# Altium project P-MT3620RDB-1-0.PrjPcb (part 2 of 4)

## Sheet P-MT3620RDB-1-0_WiFi.SchDoc: MT3620 RDB WiFi
size A3; CompanyName: Microsoft Research; DrawnBy: Stuart Taylor; Revision: 1.0; SheetNumber: 1; SheetTotal: 5; ProjectName: MT3620 Reference Development Board
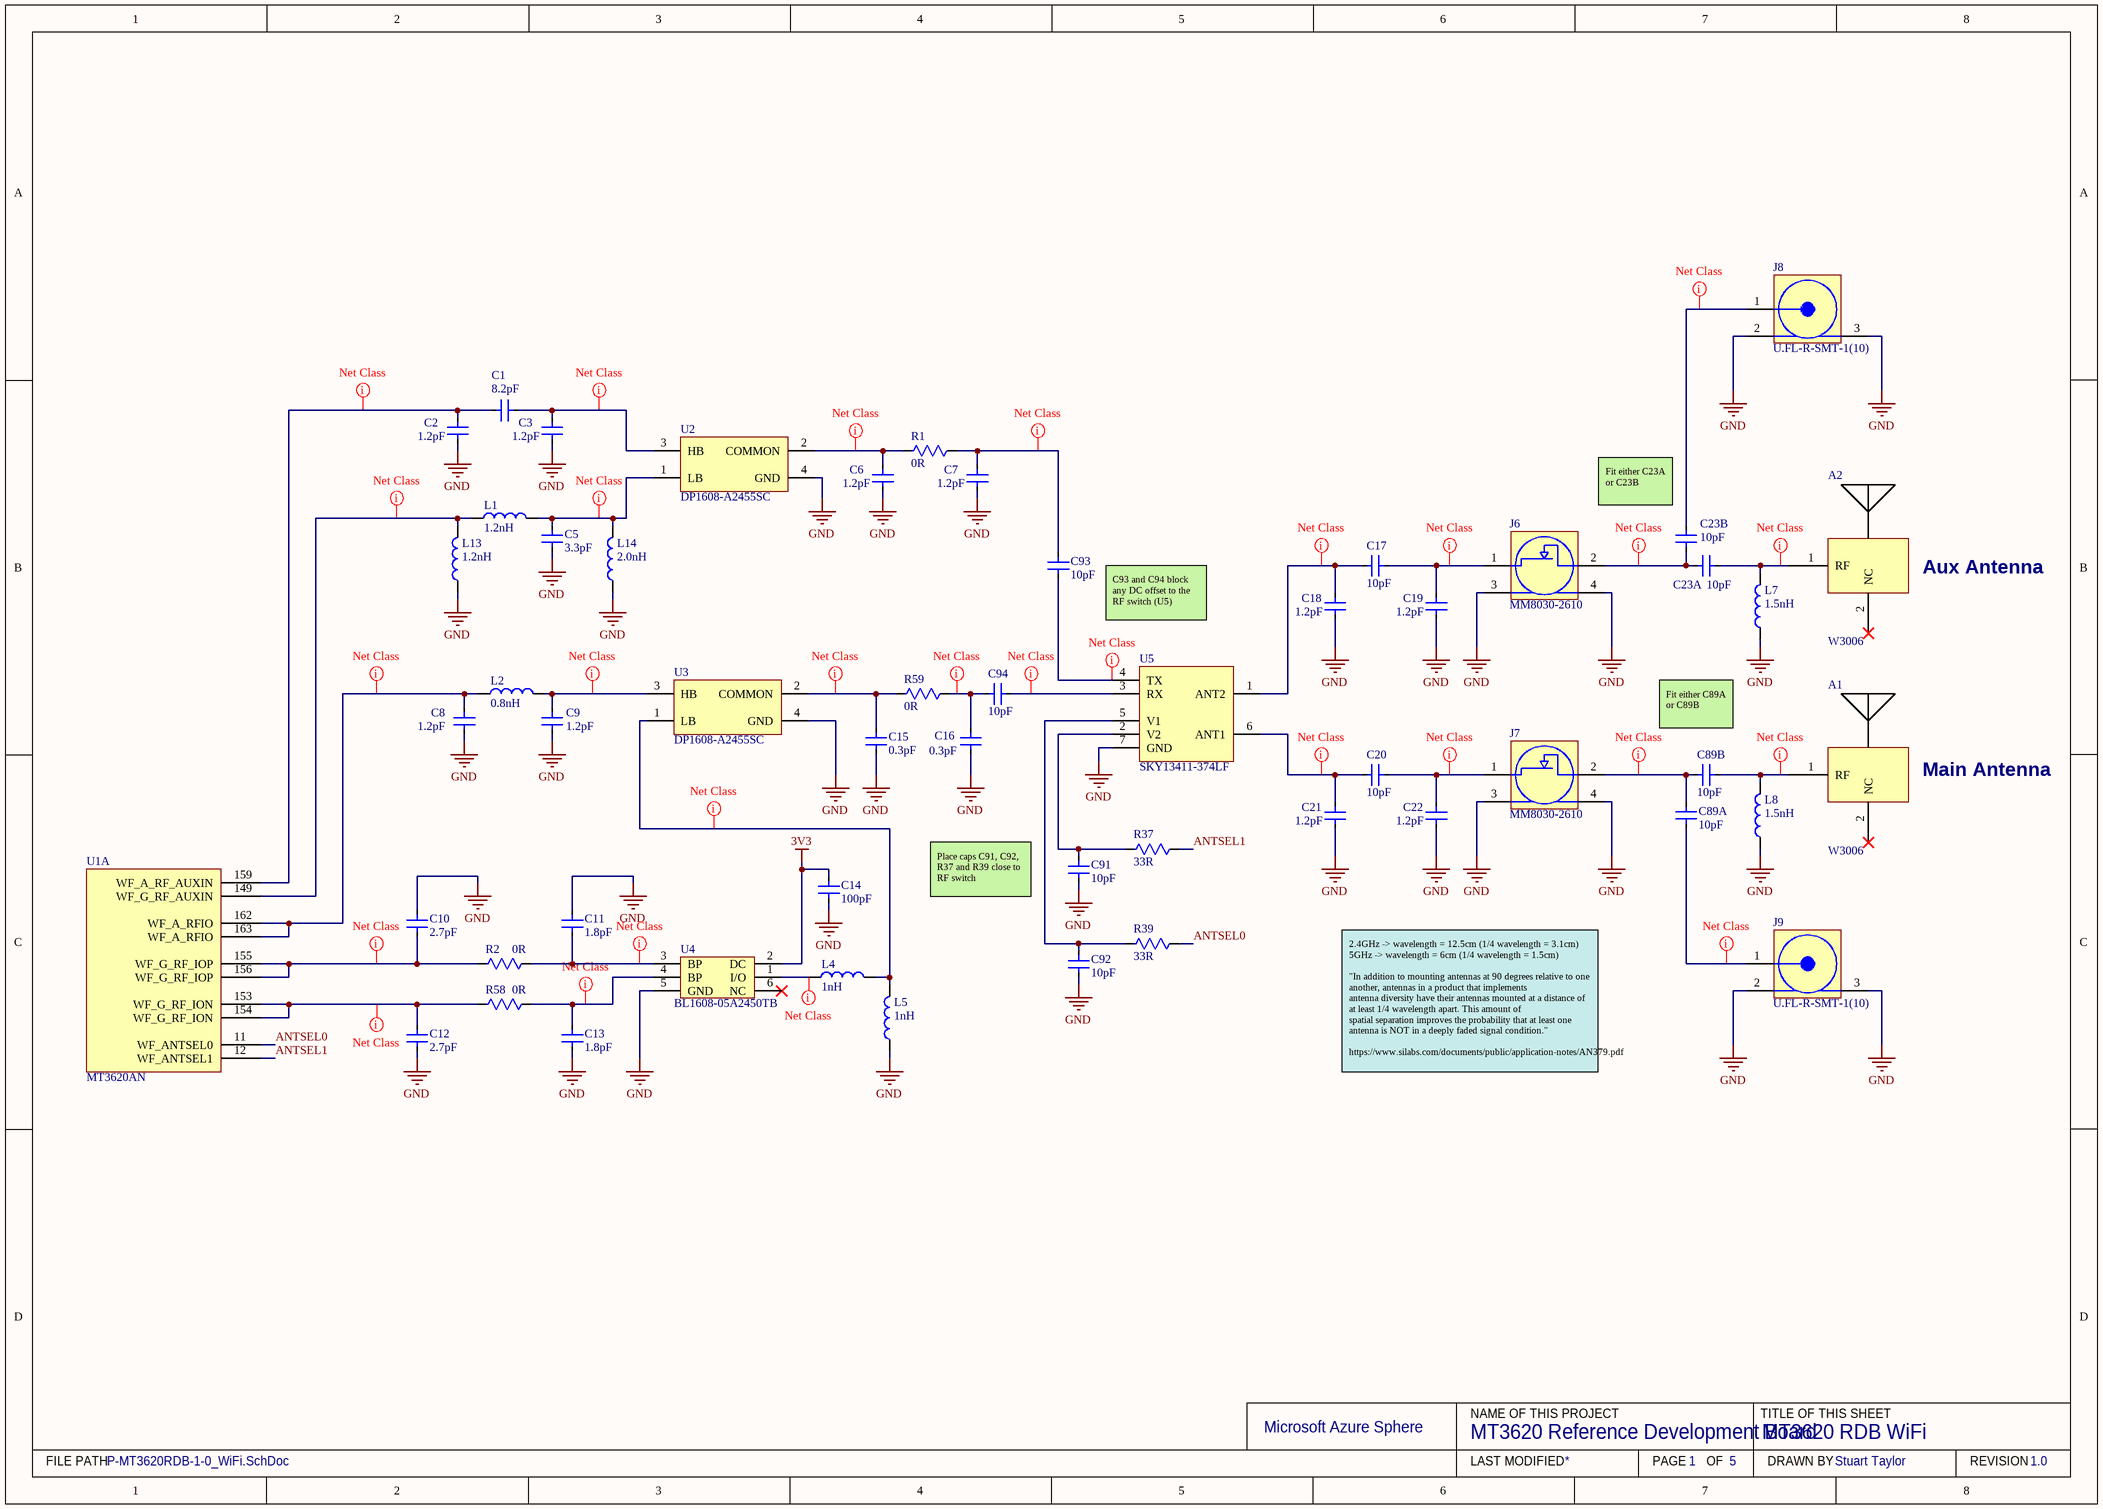
[diagram p2: P-MT3620RDB-1-0_WiFi.SchDoc]

### Parts
A1  W3006  [W3006]
A2  W3006  [W3006]
C1  8.2pF  [TDK 2010]
C2  1.2pF  [TDK 2010]
C3  1.2pF  [TDK 2010]
C5  3.3pF  [TDK 2010]
C6  1.2pF  [TDK 2010]
C7  1.2pF  [TDK 2010]
C8  1.2pF  [TDK 2010]
C9  1.2pF  [TDK 2010]
C10  2.7pF  [TDK 2010]
C11  1.8pF  [TDK 2010]
C12  2.7pF  [TDK 2010]
C13  1.8pF  [TDK 2010]
C14  100pF  [CAPC1005-EIA0402 0.55MM MED]
C15  0.3pF  [TDK 2010]
C16  0.3pF  [TDK 2010]
C17  10pF  [TDK 2010]
C18  1.2pF  [TDK 2010]
C19  1.2pF  [TDK 2010]
C20  10pF  [TDK 2010]
C21  1.2pF  [TDK 2010]
C22  1.2pF  [TDK 2010]
C23  10pF  [CAPC1005-EIA0402 0.55MM MED - THREE WAY]  (parts A,B of 2)
C89  10pF  [CAPC1005-EIA0402 0.55MM MED - THREE WAY]  (parts A,B of 2)
C91  10pF  [TDK 2010]
C92  10pF  [TDK 2010]
C93  10pF  [TDK 2010]
C94  10pF  [TDK 2010]
J6  MM8030-2610  [MM8030-2610]
J7  MM8030-2610  [MM8030-2610]
J8  U.FL-R-SMT-1(10)  [U.FL-R-SMT-1(10)]
J9  U.FL-R-SMT-1(10)  [U.FL-R-SMT-1(10)]
L1  1.2nH  [TDK 2010]
L2  0.8nH  [TDK 2010]
L4  1nH  [TDK 2010]
L5  1nH  [TDK 2010]
L7  1.5nH  [TDK 2010]
L8  1.5nH  [TDK 2010]
L13  1.2nH  [TDK 2010]
L14  2.0nH  [TDK 2010]
R1  0R  [TDK 2010]
R2  0R  [TDK 2010]
R37  33R  [RES 0402 MEDIUM DENSITY]
R39  33R  [RES 0402 MEDIUM DENSITY]
R58  0R  [TDK 2010]
R59  0R  [TDK 2010]
U1  MT3620AN  [Mt.Blanca]  (part A of 14)
U2  DP1608-A2455SC  [DP1608-A2455SC]
U3  DP1608-A2455SC  [DP1608-A2455SC]
U4  BL1608-05A2450TB  [BL1608-05A2450TB]
U5  SKY13411-374LF  [SKY13411-374LF]

### Nets
3V3: C14.2 U4.2(DC)
GND: C2.1 C3.1 C5.1 C6.1 C7.1 C8.1 C9.1 C10.2 C11.2 C12.1 C13.1 C14.1 C15.1 C16.1 C18.1 C19.1 C21.1 C22.1 C91.1 C92.1 J6.3(GND) J6.4(GND) J7.3(GND) J7.4(GND) J8.2(GND) J8.3(GND) J9.2(GND) J9.3(GND) L5.1 L7.1 L8.1 L13.1 L14.1 U2.4(GND) U3.4(GND) U4.5(GND) U5.7(GND)
ANTSEL0: R39.1 U1.11(WF_ANTSEL0)
ANTSEL1: R37.1 U1.12(WF_ANTSEL1)
NetA1_1: A1.1(RF) C89.3 L8.2
NetA2_1: A2.1(RF) C23.2 L7.2
NetC1_1: C1.1 C2.2 U1.159(WF_A_RF_AUXIN)
NetC1_2: C1.2 C3.2 U2.3(HB)
NetC5_2: C5.2 L1.2 L14.2 U2.1(LB)
NetC6_2: C6.2 R1.2 U2.2(COMMON)
NetC7_2: C7.2 C93.2 R1.1
NetC8_2: C8.2 L2.1 U1.162(WF_A_RFIO) U1.163(WF_A_RFIO)
NetC9_2: C9.2 L2.2 U3.3(HB)
NetC10_1: C10.1 R2.2 U1.155(WF_G_RF_IOP) U1.156(WF_G_RF_IOP)
NetC11_1: C11.1 R2.1 U4.3(BP)
NetC12_2: C12.2 R58.2 U1.153(WF_G_RF_ION) U1.154(WF_G_RF_ION)
NetC13_2: C13.2 R58.1 U4.4(BP)
NetC15_2: C15.2 R59.2 U3.2(COMMON)
NetC16_2: C16.2 C94.2 R59.1
NetC17_1: C17.1 C18.2 U5.1(ANT2)
NetC17_2: C17.2 C19.2 J6.1(IN)
NetC20_1: C20.1 C21.2 U5.6(ANT1)
NetC20_2: C20.2 C22.2 J7.1(IN)
NetC23_1: C23.1 J6.2(OUT)
NetC23_3: C23.3 J8.1(IN)
NetC89_1: C89.1 J7.2(OUT)
NetC89_2: C89.2 J9.1(IN)
NetC91_2: C91.2 R37.2 U5.2(V2)
NetC92_2: C92.2 R39.2 U5.5(V1)
NetC93_1: C93.1 U5.4(TX)
NetC94_1: C94.1 U5.3(RX)
NetL1_1: L1.1 L13.2 U1.149(WF_G_RF_AUXIN)
NetL4_1: L4.1 U4.1(I/O)
NetL4_2: L4.2 L5.2 U3.1(LB)

Not connected (* = marked no-connect by the designer): A1 2(NC)*; A2 2(NC)*; U4 6(NC)*

### Layout directives
net class RF: NetA1_1, NetA2_1, NetC1_1, NetC1_2, NetC5_2, NetC6_2, NetC7_2, NetC8_2, NetC9_2, NetC15_2, NetC16_2, NetC17_1, NetC17_2, NetC20_1, NetC20_2, NetC23_1, NetC23_3, NetC89_1, NetC89_2, NetC93_1, NetC94_1, NetL1_1, NetL4_1, NetL4_2
net class RFD: NetC10_1, NetC11_1, NetC12_2, NetC13_2

### Notes on the sheet
- (near C23) Fit either C23A or C23B
- Aux Antenna
- C93 and C94 block any DC offset to the RF switch (U5)
- Fit either C89A or C89B
- Main Antenna
- (near C91) Place caps C91, C92, R37 and R39 close to RF switch
- 2.4GHz -> wavelength = 12.5cm (1/4 wavelength = 3.1cm)
  5GHz -> wavelength = 6cm (1/4 wavelength = 1.5cm)
  "In addition to mounting antennas at 90 degrees relative to one another, antennas in a product that implements
  antenna diversity have their antennas mounted at a distance of at least 1/4 wavelength apart. This amount of
  spatial separation improves the probability that at least one antenna is NOT in a deeply faded signal condition."
  https://www.silabs.com/documents/public/application-notes/AN379.pdf
- Microsoft Azure Sphere
- NAME OF THIS PROJECT
- TITLE OF THIS SHEET
- FILE PATH
- LAST MODIFIED
- PAGE
- OF
- DRAWN BY
- REVISION

### Library data of the parts
A1 A2 = W3006: W3006 Chip Antenna; Manufacturer: Pulse Electronics Corporation; Frequency Group: UHF (2 GHz ~ 3 GHz), SHF (f > 4 GHz); Frequency (Center/Band): 2.4GHz, 5.5GHz; Frequency Range: 2.4GHz ~ 2.483GHz, 5.15GHz ~ 5.85GHz; Number of Bands: 2; Return Loss: -8dB, -10dB; Gain: 3.2dBi, 4.2dBi; NoThermalRelief: ture; Supplier 1: Digi-Key; Supplier Part Number 1: 553-1673-2-ND; Manufacturer Part Number: W3006; RoHS: RoHS Compliant; Category: RF/IF and RFID; Stock 1: 2000; Pricing 1: 1000=0.72505, 2000=0.67505, 5000=0.65004, 10000=0.62504 (GBP); Packaging: Tape & Reel (TR); Part Status: Active; Antenna Type: Chip; VSWR: -; Power - Max: -; Features: -; Termination: Solder; Ingress Protection: -; Mounting Type: Surface Mount; Height (Max): 0.059" (1.50mm); Applications: WLAN, Zigbee™; ComponentLink1URL: http://productfinder.pulseeng.com/products/datasheets/W3006.pdf; ComponentLink1Description: http://productfinder.pulseeng.com/products/datasheets/W3006.pdf
C1 = GJM0335C1E8R2CB01D: CAP CER 8.2PF 25V NP0 0201; Manufacturer: Murata; Dielectric: C0G; Supplier 1: Digi-Key; Manufacturer Part Number: GJM0335C1E8R2CB01D; Stock 1: 3138; Pricing 1: 1=0.1, 10=0.043, 100=0.0192, 500=0.0137, 1000=0.0108, 2500=0.0098, 5000=0.009 (USD); Mount: Surface Mount; Case/Package: 0201; Weight: 1.2E-05oz; Case Code (Imperial): 0201; Case Code (Metric): 0603; Min Operating Temperature: -55°C; Max Operating Temperature: 125°C; Capacitance: 8.2pF; Voltage Rating (DC): 25V; Packaging: Tape and Reel; Voltage Rating: 25V; Termination: SMD/SMT; Package Quantity: 15000; Length: 0.024inch; Height: 0.3mm; Width: 0.3mm; Thickness: 0.013inch; ComponentLink1URL: http://www.mouser.com/ds/2/281/Murata GJM Series-1186094.pdf; ComponentLink1Description: http://www.mouser.com/ds/2/281/Murata GJM Series-1186094.pdf; Supplier Part Number 1: 490-14540-1-ND
C2 C3 C6-C9 C18 C19 C21 C22 = 1.2pF 0201 25V: CAP CER 1.2PF 25V C0G 0201; Manufacturer: TDK Corporation; Manufacturer Part Number: C0603C0G1E1R2B; Tolerance: ±0.1pF; Temperature Coefficient: C0G, NP0; NoThermalRelief: true; Supplier 1: Digi-Key; RoHS: RoHS Compliant; Category: Capacitors; Stock 1: 891; Pricing 1: 1=0.07, 10=0.022, 100=0.0101, 250=0.00828, 500=0.00708, 1000=0.00552, 5000=0.0046 (GBP); Packaging: Cut Tape (CT); Capacitance: 1.2pF; Voltage - Rated: 25V; Mounting Type: Surface Mount, MLCC; Operating Temperature: -55°C ~ 125°C; Applications: General Purpose; Ratings: -; Package / Case: 0201 (0603 Metric); Size / Dimension: 0.024" L x 0.012" W (0.60mm x 0.30mm); Height - Seated (Max): -; Thickness (Max): 0.013" (0.33mm); Lead Spacing: -; Features: -; Lead Style: -; ComponentLink1URL: http://media.digikey.com/pdf/Data%20Sheets/TDK%20PDFs/C_Series_GeneralAppl_B11.pdf; ComponentLink1Description: http://media.digikey.com/pdf/Data%20Sheets/TDK%20PDFs/C_Series_GeneralAppl_B11.pdf; Supplier Part Number 1: 445-4594-1-ND
C5 = 3.3pF 0201 25V: Cap Ceramic 3.3pF 25V C0G 0.25pF SMD 0201 125C T/R; Manufacturer: TDK; Manufacturer Part Number: CGA1A2C0G1E3R3C030BA; NoThermalRelief: true; Supplier 1: Digi-Key; Stock 1: 1636; Pricing 1: 1=0.12, 10=0.088, 100=0.0413, 500=0.029, 1000=0.024, 2500=0.0223, 5000=0.0204 (USD); Mount: Surface Mount; Case/Package: 0201; Weight: 6E-06oz; Case Code (Metric): 0603; Case Code (Imperial): 0201; Min Operating Temperature: -55°C; Max Operating Temperature: 125°C; Packaging: Tape and Reel; Package Quantity: 1; Capacitance: 3.3pF; Voltage Rating: 25V; Voltage Rating (DC): 25V; Dielectric: C0G; Termination: SMD/SMT; Composition: Ceramic; Length: 0.6mm; Height: 0.3mm; Width: 0.012inch; Thickness: 0.013inch; Depth: 0.3mm; ComponentLink1URL: https://datasheet.ciiva.com/24220/cga1a2c0g1e3r3c030ba-272998-24220339.pdf; ComponentLink1Description: https://datasheet.ciiva.com/24220/cga1a2c0g1e3r3c030ba-272998-24220339.pdf; Supplier Part Number 1: 445-9045-6-ND
C10 C12 = 2.7pF 0201 25V: CAP CER 2.7PF 25V C0G 0201; Manufacturer: TDK; Manufacturer Part Number: C0603C0G1E2R7B; Catalog Drawings: C SERIES_0201; Tolerance: ±0.1pF; Temperature Coefficient: C0G, NP0; Kits: SAMPLE KIT 1009-ND  - KIT CAP CER RF .2PF-10PF 445-9011-KIT-ND  - KIT CAP CER RF .2PF-10PF SMD; Other Names: 445-4610-1; NoThermalRelief: true; Supplier 1: Digikey; Stock 1: 16566; Pricing 1: 1=0.1, 10=0.038, 100=0.0168, 500=0.012, 1000=0.0094, 2500=0.0086, 5000=0.0079 (USD); Standard Package: 1; Category: Capacitors; Family: Ceramic Capacitors; Series: C; Packaging: Cut Tape (CT); Capacitance: 2.7pF; Voltage - Rated: 25V; Mounting Type: Surface Mount, MLCC; Operating Temperature: -55°C ~ 125°C; Applications: General Purpose; Ratings: -; Package / Case: 0201 (0603 Metric); Size / Dimension: 0.024" L x 0.012" W (0.60mm x 0.30mm); Height - Seated (Max): -; Thickness (Max): 0.013" (0.33mm); Lead Spacing: -; Features: -; Lead Style: -; ComponentLink1URL: https://datasheet.ciiva.com/26869/getdatasheetpartid-496273-26869685.pdf; ComponentLink1Description: https://datasheet.ciiva.com/26869/getdatasheetpartid-496273-26869685.pdf; ComponentLink2URL: https://datasheet.ciiva.com/5410/general-b11-5410742.pdf; ComponentLink2Description: https://datasheet.ciiva.com/5410/general-b11-5410742.pdf; ComponentLink3URL: https://datasheet.ciiva.com/130/c-series-generalappl-b11-130943.pdf; ComponentLink3Description: https://datasheet.ciiva.com/130/c-series-generalappl-b11-130943.pdf; ComponentLink4URL: https://datasheet.ciiva.com/130/c-series-generalappl-b11-130945.pdf; ComponentLink4Description: https://datasheet.ciiva.com/130/c-series-generalappl-b11-130945.pdf; ComponentLink5URL: https://datasheet.ciiva.com/130/c-series-generalappl-b11-130944.pdf; ComponentLink5Description: https://datasheet.ciiva.com/130/c-series-generalappl-b11-130944.pdf; Supplier Part Number 1: 445-4610-1-ND
C11 C13 = GJM0335C1E1R8CB01D: CAP CER 1.8PF 25V NP0 0201; Manufacturer: Murata; Dielectric: C0G; Supplier 1: Digi-Key; Manufacturer Part Number: GJM0335C1E1R8CB01D; Stock 1: 87034; Pricing 1: 1=0.1, 10=0.043, 100=0.0192, 500=0.0137, 1000=0.0108, 2500=0.0098, 5000=0.009 (USD); Mount: Surface Mount; Case/Package: 0201; Case Code (Imperial): 0201; Case Code (Metric): 0603; Min Operating Temperature: -55°C; Max Operating Temperature: 125°C; Capacitance: 1.8pF; Package Quantity: 1; Packaging: Tape and Reel; Voltage Rating: 25V; Termination: SMD/SMT; Voltage Rating (DC): 25V; Length: 0.6mm; Height: 0.3mm; Width: 0.012inch; Thickness: 0.013inch; Depth: 0.3mm; Radiation Hardening: No; Lead Free: Lead Free; ComponentLink1URL: https://datasheet.ciiva.com/11615/product-11615586.pdf; ComponentLink1Description: https://datasheet.ciiva.com/11615/product-11615586.pdf; ComponentLink2URL: https://datasheet.ciiva.com/133/partnumbering-e-01-133454.pdf; ComponentLink2Description: https://datasheet.ciiva.com/133/partnumbering-e-01-133454.pdf; ComponentLink3URL: https://datasheet.ciiva.com/133/partnumbering-e-01-133455.pdf; ComponentLink3Description: https://datasheet.ciiva.com/133/partnumbering-e-01-133455.pdf; ComponentLink4URL: https://datasheet.ciiva.com/17453/product-17453450.pdf; ComponentLink4Description: https://datasheet.ciiva.com/17453/product-17453450.pdf; ComponentLink5URL: https://datasheet.ciiva.com/133/partnumbering-e-01-133453.pdf; ComponentLink5Description: https://datasheet.ciiva.com/133/partnumbering-e-01-133453.pdf; Supplier Part Number 1: 490-3059-1-ND
C14 = 100pF 0402 C0G, NP0 50V: CAP CER 100PF 50V 5% NP0 0402; Manufacturer: TDK Corporation; Manufacturer Part Number: C1005C0G1H101J050BA; NoThermalRelief: true; Supplier 1: Digi-Key; RoHS: RoHS Compliant; Category: Capacitors; Stock 1: 47833; Pricing 1: 0.00233; Packaging: Tape & Reel (TR); Tolerance: ±5%; Voltage - Rated: 50V; Temperature Coefficient: C0G, NP0; Mounting Type: Surface Mount, MLCC; Operating Temperature: -55°C ~ 125°C; Applications: General Purpose; Package / Case: 0402 (1005 Metric); Size / Dimension: 0.039" L x 0.020" W (1.00mm x 0.50mm); Height - Seated (Max): -; Thickness (Max): 0.022" (0.55mm); Lead Spacing: -; Features: -; Lead Style: -; ComponentLink1URL: http://product.tdk.com/en/catalog/datasheets/mlcc_commercial_general_en.pdf; ComponentLink1Description: http://product.tdk.com/en/catalog/datasheets/mlcc_commercial_general_en.pdf; Supplier Part Number 1: 445-1247-2-ND; Ratings: -; Capacitance: 100pF
C15 C16 = 0.3pF 0201 25V: CAP CER 0.3PF 25V C0G 0201; Manufacturer: TDK Corporation; Manufacturer Part Number: C0603C0G1E0R3B; Capacitance: 0.30pF; Tolerance: ±0.1pF; Temperature Coefficient: C0G, NP0; NoThermalRelief: true; Supplier 1: Digi-Key; RoHS: RoHS Compliant; Category: Capacitors; Stock 1: 19260; Pricing 1: 1=0.07, 10=0.03, 100=0.0139, 250=0.01132, 500=0.0097, 1000=0.00756, 5000=0.0063 (GBP); Packaging: Cut Tape (CT); Voltage - Rated: 25V; Mounting Type: Surface Mount, MLCC; Operating Temperature: -55°C ~ 125°C; Applications: General Purpose; Ratings: -; Package / Case: 0201 (0603 Metric); Size / Dimension: 0.024" L x 0.012" W (0.60mm x 0.30mm); Height - Seated (Max): -; Thickness (Max): 0.013" (0.33mm); Lead Spacing: -; Features: -; Lead Style: -; ComponentLink1URL: http://media.digikey.com/pdf/Data%20Sheets/TDK%20PDFs/C_Series_GeneralAppl_B11.pdf; ComponentLink1Description: http://media.digikey.com/pdf/Data%20Sheets/TDK%20PDFs/C_Series_GeneralAppl_B11.pdf; Supplier Part Number 1: 445-7205-1-ND
C17 C20 C91-C94 = 10pF 0201 25V: CAP CER 10PF 25V C0G 0201; Manufacturer: TDK Corporation; Manufacturer Part Number: C0603C0G1E100D030BA; Tolerance: ±0.5pF; Temperature Coefficient: C0G, NP0; NoThermalRelief: true; Supplier 1: Digi-Key; RoHS: RoHS Compliant; Category: Capacitors; Stock 1: 331754; Pricing 1: 1=0.07, 10=0.03, 100=0.0139, 250=0.01132, 500=0.0097, 1000=0.00756, 5000=0.0063 (GBP); Packaging: Digi-Reel®; Capacitance: 10pF; Voltage - Rated: 25V; Mounting Type: Surface Mount, MLCC; Operating Temperature: -55°C ~ 125°C; Applications: General Purpose; Ratings: -; Package / Case: 0201 (0603 Metric); Size / Dimension: 0.024" L x 0.012" W (0.60mm x 0.30mm); Height - Seated (Max): -; Thickness (Max): 0.013" (0.33mm); Lead Spacing: -; Features: Low ESL; Lead Style: -; ComponentLink1URL: https://product.tdk.com/info/en/catalog/datasheets/mlcc_commercial_general_en.pdf; ComponentLink1Description: https://product.tdk.com/info/en/catalog/datasheets/mlcc_commercial_general_en.pdf; Supplier Part Number 1: 445-4651-6-ND
C23 C89 = 10pF 0402 C0G, NP0 50V_1: CAP CER 10PF 50V NP0 0402 - Three-way pads; Manufacturer: TDK Corporation; Manufacturer Part Number: C1005C0G1H100D050BA; Tolerance: ±0.5pF; NoThermalRelief: true; Supplier 1: Digi-Key; RoHS: RoHS Compliant; Category: Capacitors; Stock 1: 47833; Pricing 1: 0.00274; Packaging: Tape & Reel (TR); Voltage - Rated: 50V; Temperature Coefficient: C0G, NP0; Mounting Type: Surface Mount, MLCC; Operating Temperature: -55°C ~ 125°C; Applications: General Purpose; Package / Case: 0402 (1005 Metric); Size / Dimension: 0.039" L x 0.020" W (1.00mm x 0.50mm); Height - Seated (Max): -; Thickness (Max): 0.022" (0.55mm); Lead Spacing: -; Features: -; Lead Style: -; ComponentLink1URL: http://product.tdk.com/en/catalog/datasheets/mlcc_commercial_general_en.pdf; ComponentLink1Description: http://product.tdk.com/en/catalog/datasheets/mlcc_commercial_general_en.pdf; Supplier Part Number 1: 445-1235-2-ND; Ratings: -; Capacitance: 10pF
J6 J7 = MM8030-2610: CONN UMC RECEPT SMD 2x2mm; Manufacturer: Murata Electronics North America; Manufacturer Part Number: MM8030-2610RK0; Connector Style: Ultra Miniature Coaxial; Connector Type: Receptacle, Female Socket; Contact Termination: Solder; Impedance: 50 Ohm; Frequency - Max: 11GHz; Center Contact Plating: Gold; Voltage Rating: 30V; NoThermalRelief: true; Supplier 1: Digi-Key; RoHS: RoHS Compliant; Category: Connectors, Interconnects; Stock 1: 11893; Pricing 1: 1=0.34, 10=0.325, 25=0.2788, 50=0.2368, 100=0.2276, 250=0.2044, 500=0.1951, 1000=0.16258, 2500=0.14864 (GBP); Packaging: Cut Tape (CT); Shield Termination: Solder; Mounting Type: Surface Mount; Cable Group: -; Fastening Type: Snap-On; Features: Internal Switch; Housing Color: -; Ingress Protection: -; Body Material: -; Body Finish: -; Center Contact Material: -; Dielectric Material: -; Operating Temperature: -40°C ~ 85°C; ComponentLink1URL: http://www.murata.com/~/media/webrenewal/support/library/catalog/products/switch/switch/o33e.ashx; ComponentLink1Description: http://www.murata.com/~/media/webrenewal/support/library/catalog/products/switch/switch/o33e.ashx; Supplier Part Number 1: 490-11804-1-ND
J8 J9 = U.FL-R-SMT-1(10): CONN UMC JACK STR 50 OHM SMD; Manufacturer: Hirose Electric (HRS); Featured Product: U.FL Series Connectors; Connector Style: U.FL, Ultra Miniature Coaxial; Connector Type: Receptacle, Male Pin; Contact Termination: Solder; Impedance: 50 Ohm; Frequency - Max: 6GHz; Body Material: Phosphor Bronze; Body Finish: Silver; Center Contact Material: Brass; Center Contact Plating: Gold; Dielectric Material: Liquid Crystal Polymer (LCP); Online Catalog: UMCC (Ultra Miniature Coax Connectors), U.FL Series; Other Names: H11891TR  Q5400621  U.FL-R-SMT-1 10  U.FL-R-SMT-1(10)-ND  UFLRSMT110; NoThermalRelief: true; Supplier 1: Farnell; Manufacturer Part Number: U.FL-R-SMT-1(10); Stock 1: 11130; Pricing 1: 1=0.84, 10=0.77 (GBP); Standard Package: 2,500; Category: Connectors, Interconnects; Family: Coaxial Connectors (RF); Series: U.FL; Packaging: Tape & Reel (TR); Shield Termination: Solder; Mounting Type: Surface Mount; Cable Group: -; Fastening Type: Snap-On; Features: -; Housing Color: Beige; Ingress Protection: -; Voltage Rating: -; Operating Temperature: -40°C ~ 90°C; ComponentLink1URL: https://datasheet.ciiva.com/11762/0900766b8105243f-11762474.pdf; ComponentLink1Description: https://datasheet.ciiva.com/11762/0900766b8105243f-11762474.pdf; ComponentLink2URL: https://datasheet.ciiva.com/7651/91524-7651915.pdf; ComponentLink2Description: https://datasheet.ciiva.com/7651/91524-7651915.pdf; ComponentLink3URL: https://datasheet.ciiva.com/7651/91524-7651914.pdf; ComponentLink3Description: https://datasheet.ciiva.com/7651/91524-7651914.pdf; Supplier Part Number 1: 1688077RL
L1 L13 = 1.2nH 0201: FIXED IND 1.2NH 1A 80 MOHM SMD; Manufacturer: TDK; Manufacturer Part Number: MHQ0603P1N2CT000; Core Material: Non-Magnetic; Shielding: Unshielded; DC Resistance (DCR): 80mR; Self Resonant Frequency: 10GHz; Test Frequency: 500MHz; NoThermalRelief: true; Supplier 1: Digi-Key; Stock 1: 13400; Pricing 1: 1=0.51, 10=0.443, 100=0.3163, 500=0.2657, 1000=0.2151, 2500=0.2024 (USD); Mount: Surface Mount; Case/Package: 0201; Case Code (Metric): 0603; Case Code (Imperial): 0201; Min Operating Temperature: -55°C; Max Operating Temperature: 125°C; Package Quantity: 15000; Packaging: Tape and Reel; Current Rating: 1A; Inductance: 1.2nh; Length: 0.026inch; Width: 0.014inch; Height - Seated (Max): 0.016inch; ComponentLink1URL: http://product.tdk.com/inductor/ind/en/documents/inductor_commercial_high-frequency_mhq_en.pdf; ComponentLink1Description: http://product.tdk.com/inductor/ind/en/documents/inductor_commercial_high-frequency_mhq_en.pdf; Supplier Part Number 1: 445-16782-6-ND
L2 = 0.8nH 0201: FIXED IND 0.8NH 1A 70 MOHM SMD; Manufacturer: TDK Corporation; Manufacturer Part Number: MHQ0603P0N8CT000; Type: Multilayer; Material - Core: Non-Magnetic; Tolerance: ±0.2nH; Shielding: Unshielded; DC Resistance (DCR): 70 mOhm Max; Frequency - Self Resonant: 10GHz; Frequency - Test: 500MHz; Supplier 1: Digi-Key; RoHS: RoHS Compliant; Category: Inductors, Coils, Chokes; Stock 1: 28900; Pricing 1: 1=0.31, 10=0.272, 50=0.2214, 100=0.2043, 500=0.17708, 1000=0.14984 (GBP); Packaging: Cut Tape (CT); Inductance: 0.8nH; Current Rating: 1A; Current - Saturation: -; Q @ Freq: -; Ratings: -; Operating Temperature: -55°C ~ 125°C; Mounting Type: Surface Mount; Package / Case: 0201 (0603 Metric); Size / Dimension: 0.026" L x 0.014" W (0.65mm x 0.35mm); Height - Seated (Max): 0.016" (0.40mm); ComponentLink1URL: https://product.tdk.com/info/en/catalog/datasheets/inductor_commercial_high-frequency_mhq0603p_en.pdf; ComponentLink1Description: https://product.tdk.com/info/en/catalog/datasheets/inductor_commercial_high-frequency_mhq0603p_en.pdf; Supplier Part Number 1: 445-16758-1-ND
L4 L5 = 1nH 0201: FIXED IND 1NH 1A 70 MOHM SMD; Manufacturer: TDK Corporation; Manufacturer Part Number: MHQ0603P1N0CT000; Type: Multilayer; Material - Core: Non-Magnetic; Tolerance: ±0.2nH; Shielding: Unshielded; DC Resistance (DCR): 70 mOhm Max; Frequency - Self Resonant: 10GHz; Frequency - Test: 500MHz; NoThermalRelief: true; Supplier 1: Digi-Key; RoHS: RoHS Compliant; Category: Inductors, Coils, Chokes; Stock 1: 28900; Pricing 1: 1=0.34, 10=0.3, 50=0.2436, 100=0.2248, 500=0.1948, 1000=0.16483 (GBP); Packaging: Cut Tape (CT); Inductance: 1nH; Current Rating: 1A; Current - Saturation: -; Q @ Freq: -; Ratings: -; Operating Temperature: -55°C ~ 125°C; Mounting Type: Surface Mount; Package / Case: 0201 (0603 Metric); Size / Dimension: 0.026" L x 0.014" W (0.65mm x 0.35mm); Height - Seated (Max): 0.016" (0.40mm); ComponentLink1URL: https://product.tdk.com/info/en/catalog/datasheets/inductor_commercial_high-frequency_mhq0603p_en.pdf; ComponentLink1Description: https://product.tdk.com/info/en/catalog/datasheets/inductor_commercial_high-frequency_mhq0603p_en.pdf; Supplier Part Number 1: 445-16776-1-ND
L7 L8 = LQP03TN1N5B02D: MURATA - LQP03TN1N5B02D - INDUCTOR, 1.5NH, 0.6A, 0.1NH, 15GHZ; Product Range: LQP03; Inductance: 1.5; DC Current Rating: 600; High Frequency Inductor Case: 0201 [0603 Metric]; Inductor Construction: Thin Film; DC Resistance Max: 0.15; Inductance Tolerance: ± 0.1; Self Resonant Frequency Min: 15; SVHC: No SVHC (17-Dec-2015; NoThermalRelief: true; Supplier 1: Farnell; Manufacturer: MURATA; Manufacturer Part Number: LQP03TN1N5B02D; RoHS: YES; Stock 1: 2224; Pricing 1: 10=0.0488, 100=0.037, 500=0.0284, 2500=0.023, 7500=0.021, 15000=0.0179, 75000=0.0163, 150000=0.016 (GBP); Packaging: Cut Tape; ComponentLink1URL: http://www.farnell.com/datasheets/1888754.pdf; ComponentLink1Description: http://www.farnell.com/datasheets/1888754.pdf; Supplier Part Number 1: 2470348RL
L14 = 2.0nH 0201: FIXED IND 2NH 700MA 120 MOHM SMD; Manufacturer: TDK; Manufacturer Part Number: MHQ0603P2N0CT000; Core Material: Non-Magnetic; Shielding: Unshielded; DC Resistance (DCR): 120mR; Self Resonant Frequency: 10GHz; Test Frequency: 500MHz; NoThermalRelief: true; Supplier 1: Digi-Key; Stock 1: 13400; Pricing 1: 1=0.51, 10=0.443, 100=0.3163, 500=0.2657, 1000=0.2151, 2500=0.2024 (USD); Mount: Surface Mount; Case/Package: 0201; Case Code (Metric): 0603; Case Code (Imperial): 0201; Min Operating Temperature: -55°C; Max Operating Temperature: 125°C; Package Quantity: 15000; Packaging: Cut Tape; Current Rating: 700mA; Inductance: 2nh; Length: 0.026inch; Width: 0.014inch; Height - Seated (Max): 0.016inch; ComponentLink1URL: https://datasheet.ciiva.com/41830/inductor-commercial-high-frequency-mhq-en-41830309.pdf; ComponentLink1Description: https://datasheet.ciiva.com/41830/inductor-commercial-high-frequency-mhq-en-41830309.pdf; Supplier Part Number 1: 445-16814-1-ND
R1 R2 R58 R59 = 0R 0201: RES SMD 0.0OHM JUMPER 1/20W 0201; Manufacturer: Panasonic Electronic Components; Manufacturer Part Number: ERJ-1GN0R00C; Resistance (Ohms): 0.0; Power (Watts): 0.05W, 1/20W; NoThermalRelief: true; Supplier 1: Digi-Key; RoHS: RoHS Compliant; Category: Resistors; Stock 1: 620507; Pricing 1: 1=0.07, 50=0.0212, 100=0.0161, 250=0.01196, 500=0.00882, 1000=0.00588, 5000=0.00414 (GBP); Packaging: Cut Tape (CT); Tolerance: Jumper; Composition: Thick Film; Features: Automotive AEC-Q200; Temperature Coefficient: -; Operating Temperature: -55°C ~ 125°C; Package / Case: 0201 (0603 Metric); Supplier Device Package: 0201; Size / Dimension: 0.024" L x 0.012" W (0.60mm x 0.30mm); Height: 0.010" (0.26mm); Number of Terminations: 2; ComponentLink1URL: http://industrial.panasonic.com/www-cgi/jvcr13pz.cgi?E+PZ+3+AOA0001+ERJ1GN0R00C+8+WW; ComponentLink1Description: http://industrial.panasonic.com/www-cgi/jvcr13pz.cgi?E+PZ+3+AOA0001+ERJ1GN0R00C+8+WW; Supplier Part Number 1: P15979CT-ND
R37 R39 = 33R: RES 33 OHM 1/10W 1% 0402 SMD; Manufacturer: Panasonic Electronic Components; Manufacturer Part Number: ERJ-2RKF33R0X; Power (Watts): 0.1W, 1/10W; Temperature Coefficient: ±100ppm/°C; Supplier 1: Digi-Key; RoHS: RoHS Compliant; Category: Resistors; Stock 1: 533394; Pricing 1: 1=0.07, 50=0.0128, 100=0.0097, 250=0.0072, 500=0.00532, 1000=0.00355, 5000=0.0025 (GBP); Packaging: Cut Tape (CT); Tolerance: ±1%; Composition: Thick Film; Features: -; Package / Case: 0402 (1005 Metric); Supplier Device Package: 0402; Size / Dimension: 0.039" L x 0.020" W (1.00mm x 0.50mm); Height: 0.016" (0.40mm); Number of Terminations: 2; ComponentLink1URL: http://industrial.panasonic.com/www-cgi/jvcr13pz.cgi?E+PZ+3+AOA0002+ERJ2RKF33R0X+7+WW; ComponentLink1Description: http://industrial.panasonic.com/www-cgi/jvcr13pz.cgi?E+PZ+3+AOA0002+ERJ2RKF33R0X+7+WW; Supplier Part Number 1: P33.0LCT-ND; Resistance (Ohms): 33R
U1 = MT3620AN: Manufacturer 1: MediaTek Inc.; Do Not Substitute: true; Manufacturer Part Number 1: MT3620AN; Supplier Part Number 1: MT3620AN; Supplier 1: MediaTek Inc.
U2 U3 = DP1608-A2455SC: Diplexer; Manufacturer 1: ACX; NoThermalRelief: true; Manufacturer Part Number 1: DP1608-A2455SC; Supplier Part Number 1: DP1608-A2455SC; Mounting Type: Surface Mount; Pricing 1: 1500=0.1 (USD); Do Not Substitute: true
  U2: Supplier: ACX
  U3: Supplier 1: ACX
U4 = BL1608-05A2450TB: Balun; Manufacturer 1: ACX; NoThermalRelief: true; Manufacturer Part Number 1: BL1608-05A2450TB; Supplier 1: ACX; Supplier Part Number 1: BL1608-05A2450TB; Mounting Type: Surface Mount; Pricing 1: 1500=0.1 (USD); Do Not Substitute: true
U5 = SKY13411-374LF: RF SWITCH; Manufacturer: Skyworks Solutions Inc.; Frequency - Lower: 100MHz; Frequency - Upper: 6GHz; Isolation @ Frequency: 14dB @ 6GHz (typ); Insertion Loss @ Frequency: 0.9dB @ 6GHz; IIP3: 50dBm (typ); Topology: Reflective; Circuit: DPDT; P1dB: 30dBm (typ) IP1dB; Impedance: 50 Ohm; RF Type: 802.11a/b/g/n; NoThermalRelief: true; Supplier 1: Digi-Key; Manufacturer Part Number: SKY13411-374LF; RoHS: RoHS Compliant; Category: RF/IF and RFID; Stock 1: 13260; Pricing 1: 1=0.31, 100=0.2478 (GBP); Packaging: Cut Tape (CT); Features: -; Operating Temperature: -40°C ~ 85°C; Voltage - Supply: -; Package / Case: 6-XFDFN Exposed Pad; Supplier Device Package: 6-MLPD (1.5x1.5); ComponentLink1URL: http://www.skyworksinc.com/uploads/documents/201665B.pdf; ComponentLink1Description: http://www.skyworksinc.com/uploads/documents/201665B.pdf; Supplier Part Number 1: 863-1455-1-ND

## Sheet P-MT3620RDB-1-0_PMU.SchDoc: MT3620 RDB PMU
size A3; CompanyName: Microsoft Research; DrawnBy: Stuart Taylor; Revision: 1.0; SheetNumber: 3; SheetTotal: 5; ProjectName: MT3620 Reference Development Board
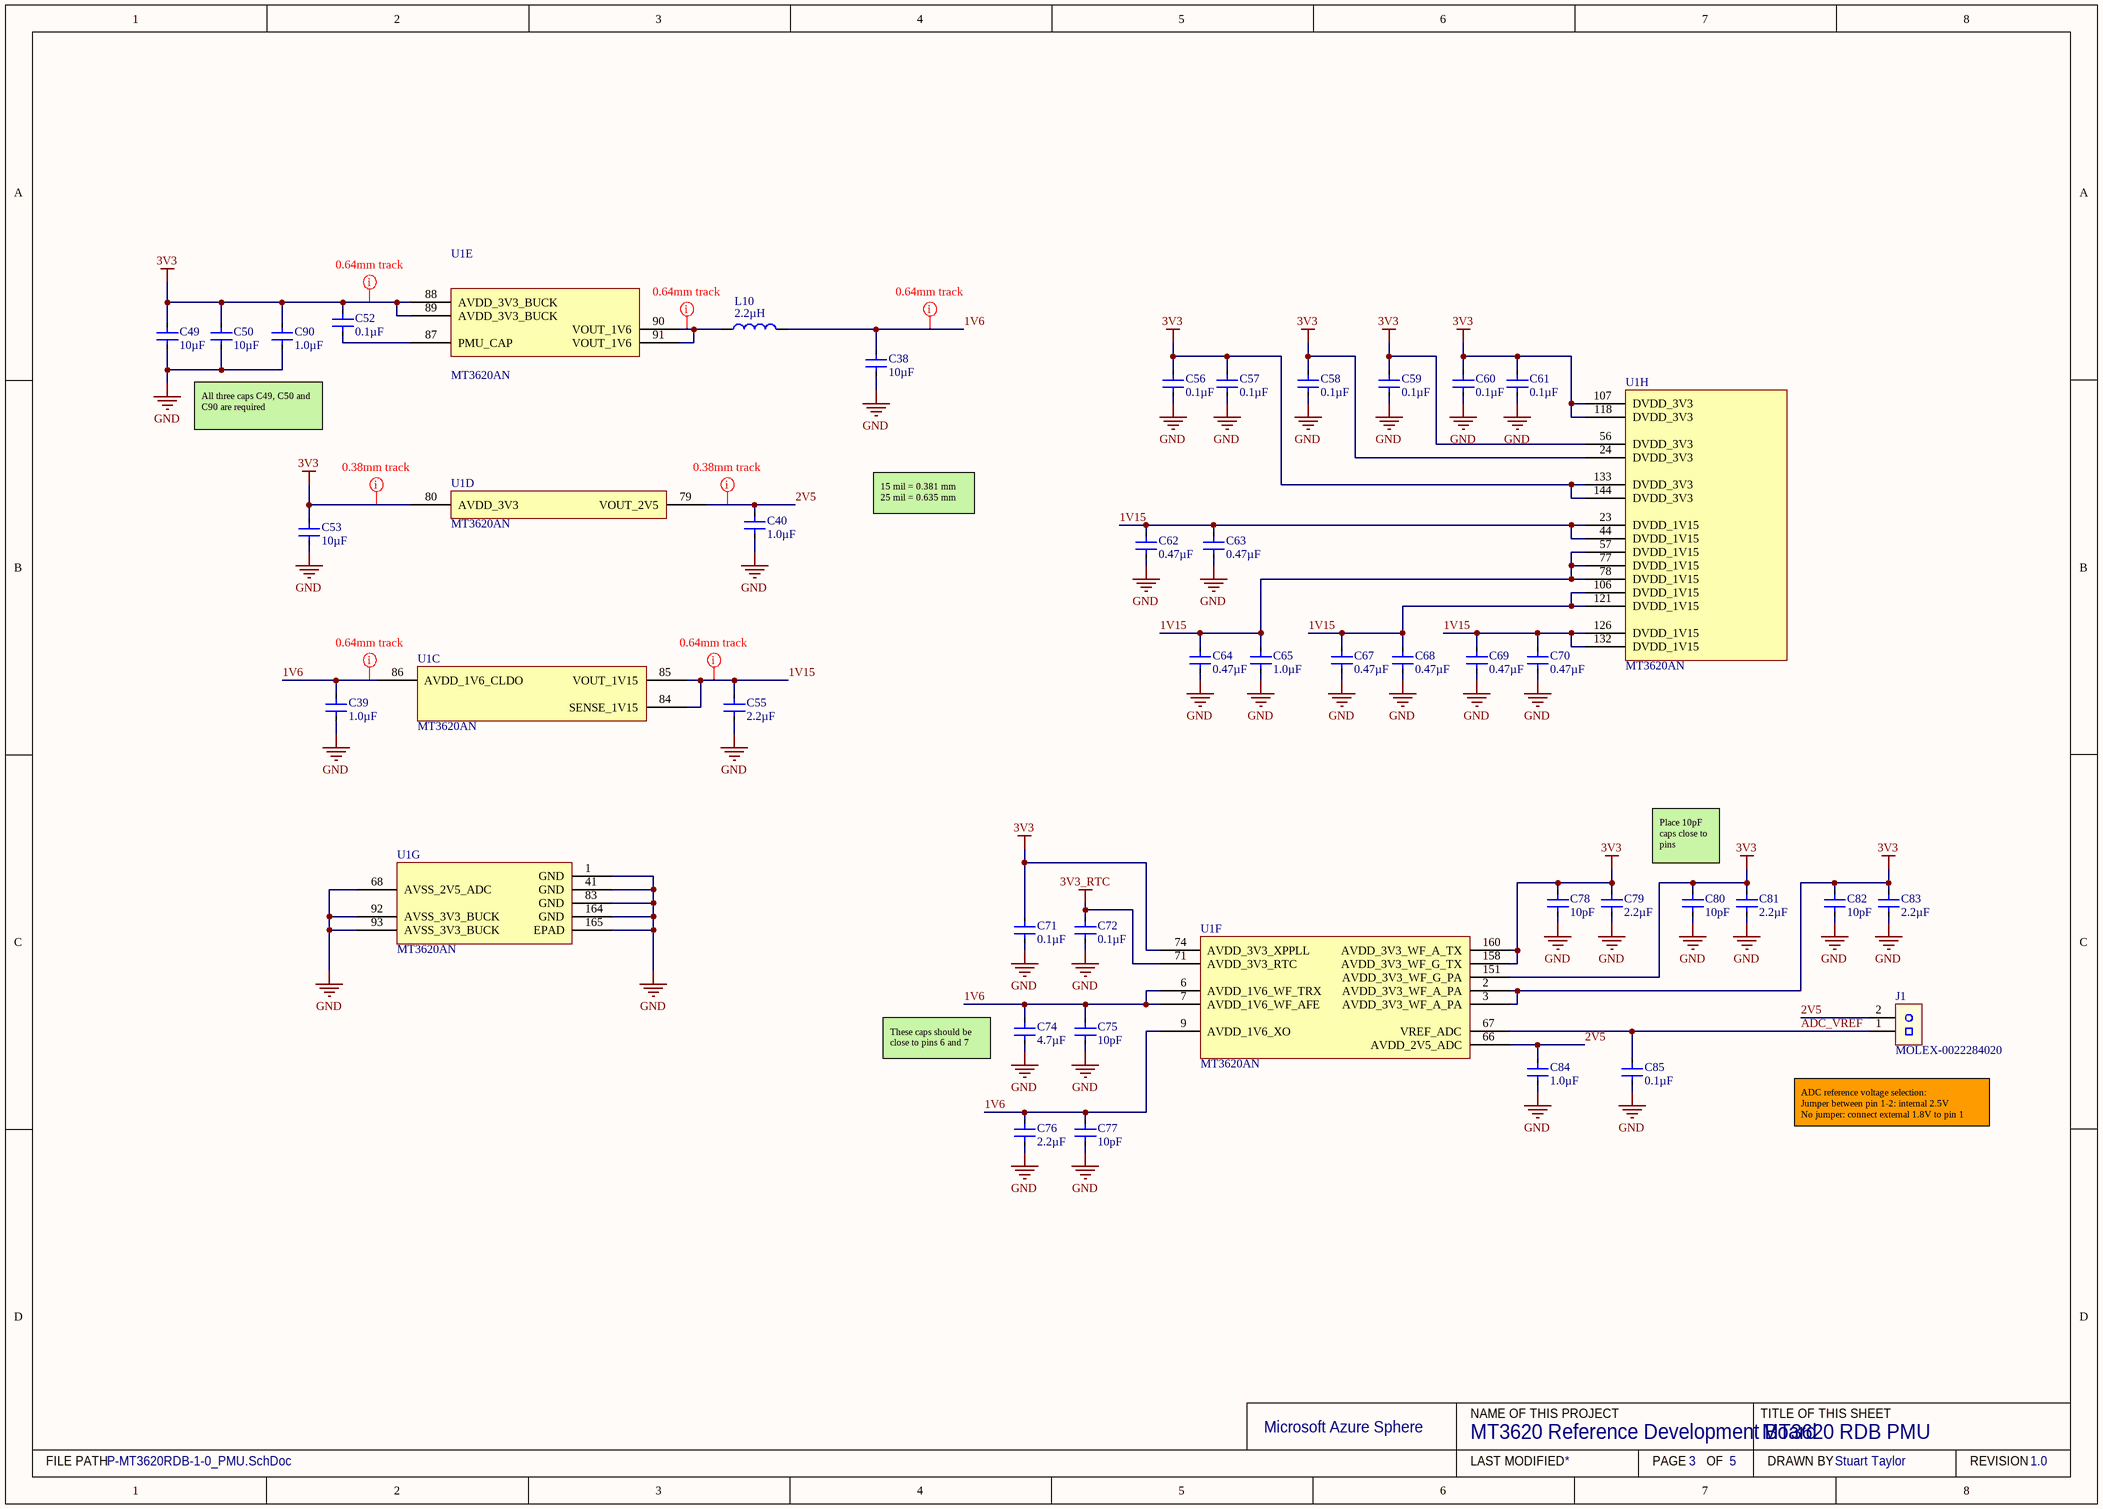
[diagram p3: P-MT3620RDB-1-0_PMU.SchDoc]

### Parts
C38  10µF  [CAPC1608-EIA0603-1MM-MED]
C39  1.0µF  [CAPC1005-EIA0402 0.55MM MED]
C40  1.0µF  [CAPC1005-EIA0402 0.55MM MED]
C49  10µF  [CAPC1005-EIA0402 0.55MM MED]
C50  10µF  [CAPC1005-EIA0402 0.55MM MED]
C52  0.1µF  [CAPC1005-EIA0402 0.55MM MED]
C53  10µF  [CAPC1005-EIA0402 0.55MM MED]
C55  2.2µF  [CAPC1005-EIA0402 0.55MM MED]
C56  0.1µF  [CAPC1005-EIA0402 0.55MM MED]
C57  0.1µF  [CAPC1005-EIA0402 0.55MM MED]
C58  0.1µF  [CAPC1005-EIA0402 0.55MM MED]
C59  0.1µF  [CAPC1005-EIA0402 0.55MM MED]
C60  0.1µF  [CAPC1005-EIA0402 0.55MM MED]
C61  0.1µF  [CAPC1005-EIA0402 0.55MM MED]
C62  0.47µF  [CAPC1005-EIA0402 0.55MM MED]
C63  0.47µF  [CAPC1005-EIA0402 0.55MM MED]
C64  0.47µF  [CAPC1005-EIA0402 0.55MM MED]
C65  1.0µF  [CAPC1005-EIA0402 0.55MM MED]
C67  0.47µF  [CAPC1005-EIA0402 0.55MM MED]
C68  0.47µF  [CAPC1005-EIA0402 0.55MM MED]
C69  0.47µF  [CAPC1005-EIA0402 0.55MM MED]
C70  0.47µF  [CAPC1005-EIA0402 0.55MM MED]
C71  0.1µF  [CAPC1005-EIA0402 0.55MM MED]
C72  0.1µF  [CAPC1005-EIA0402 0.55MM MED]
C74  4.7µF  [CAPC1005-EIA0402 0.55MM MED]
C75  10pF  [CAPC1005-EIA0402 0.55MM MED]
C76  2.2µF  [CAPC1005-EIA0402 0.55MM MED]
C77  10pF  [CAPC1005-EIA0402 0.55MM MED]
C78  10pF  [CAPC1005-EIA0402 0.55MM MED]
C79  2.2µF  [CAPC1005-EIA0402 0.55MM MED]
C80  10pF  [CAPC1005-EIA0402 0.55MM MED]
C81  2.2µF  [CAPC1005-EIA0402 0.55MM MED]
C82  10pF  [CAPC1005-EIA0402 0.55MM MED]
C83  2.2µF  [CAPC1005-EIA0402 0.55MM MED]
C84  1.0µF  [CAPC1005-EIA0402 0.55MM MED]
C85  0.1µF  [CAPC1005-EIA0402 0.55MM MED]
C90  1.0µF  [CAPC1005-EIA0402 0.55MM MED]
J1  MOLEX-0022284020  [0022284020]
L10  2.2µH  [MAMK2520T2R2M]
U1  MT3620AN  [MT3620_MaskSquaresVias50]  (parts C,D,E,F,G,H of 14)

### Nets
3V3: C49.2 C50.2 C52.2 C53.2 C56.2 C57.2 C58.2 C59.2 C60.2 C61.2 C71.2 C78.2 C79.2 C80.2 C81.2 C82.2 C83.2 C90.2 U1.2(AVDD_3V3_WF_A_PA) U1.3(AVDD_3V3_WF_A_PA) U1.24(DVDD_3V3) U1.56(DVDD_3V3) U1.74(AVDD_3V3_XPPLL) U1.80(AVDD_3V3) U1.88(AVDD_3V3_BUCK) U1.89(AVDD_3V3_BUCK) U1.107(DVDD_3V3) U1.118(DVDD_3V3) U1.133(DVDD_3V3) U1.144(DVDD_3V3) U1.151(AVDD_3V3_WF_G_PA) U1.158(AVDD_3V3_WF_G_TX) U1.160(AVDD_3V3_WF_A_TX)
3V3_RTC: C72.2 U1.71(AVDD_3V3_RTC)
GND: C38.1 C39.1 C40.1 C49.1 C50.1 C53.1 C55.1 C56.1 C57.1 C58.1 C59.1 C60.1 C61.1 C62.1 C63.1 C64.1 C65.1 C67.1 C68.1 C69.1 C70.1 C71.1 C72.1 C74.1 C75.1 C76.1 C77.1 C78.1 C79.1 C80.1 C81.1 C82.1 C83.1 C84.1 C85.1 C90.1 U1.1(GND) U1.41(GND) U1.68(AVSS_2V5_ADC) U1.83(GND) U1.92(AVSS_3V3_BUCK) U1.93(AVSS_3V3_BUCK) U1.164(GND) U1.165(EPAD)
1V6: C38.2 C39.2 C74.2 C75.2 C76.2 C77.2 L10.2 U1.6(AVDD_1V6_WF_TRX) U1.7(AVDD_1V6_WF_AFE) U1.9(AVDD_1V6_XO) U1.86(AVDD_1V6_CLDO)
1V15: C55.2 C62.2 C63.2 C64.2 C65.2 C67.2 C68.2 C69.2 C70.2 U1.23(DVDD_1V15) U1.44(DVDD_1V15) U1.57(DVDD_1V15) U1.77(DVDD_1V15) U1.78(DVDD_1V15) U1.84(SENSE_1V15) U1.85(VOUT_1V15) U1.106(DVDD_1V15) U1.121(DVDD_1V15) U1.126(DVDD_1V15) U1.132(DVDD_1V15)
2V5: C40.2 C84.2 J1.2 U1.66(AVDD_2V5_ADC) U1.79(VOUT_2V5)
ADC_VREF: C85.2 J1.1 U1.67(VREF_ADC)
NetC52_1: C52.1 U1.87(PMU_CAP)
NetL10_1: L10.1 U1.90(VOUT_1V6) U1.91(VOUT_1V6)

### Layout directives
rule Undefined: 1V6, 1V15, 2V5, 3V3, NetL10_1

### Notes on the sheet
- All three caps C49, C50 and C90 are required
- 15 mil = 0.381 mm
  25 mil = 0.635 mm
- Place 10pF caps close to pins
- (near C74) These caps should be close to pins 6 and 7
- (near J1) ADC reference voltage selection:
  Jumper between pin 1-2: internal 2.5V
  No jumper: connect external 1.8V to pin 1
- Microsoft Azure Sphere
- NAME OF THIS PROJECT
- TITLE OF THIS SHEET
- FILE PATH
- LAST MODIFIED
- PAGE
- OF
- DRAWN BY
- REVISION

### Library data of the parts
C38 = 10µF 0603 X5R 25V: CAP CER 10UF 25V 20% X5R 0603; Manufacturer: TDK Corporation; Manufacturer Part Number: C1608X5R1E106M080AC; Supplier 1: Digi-Key; RoHS: RoHS Compliant; Category: Capacitors; Stock 1: 47833; Pricing 1: 0.00754; Packaging: Tape & Reel (TR); Tolerance: ±20%; Voltage - Rated: 25V; Temperature Coefficient: X5R; Mounting Type: Surface Mount, MLCC; Operating Temperature: -55°C ~ 125°C; Applications: General Purpose; Package / Case: 0603 (1608 Metric); Size / Dimension: 0.063" L x 0.031" W (1.60mm x 0.80mm); Height - Seated (Max): -; Thickness (Max): 0.039" (1.00mm); Lead Spacing: -; Features: -; Lead Style: -; ComponentLink1URL: http://product.tdk.com/en/catalog/datasheets/mlcc_commercial_general_en.pdf; ComponentLink1Description: http://product.tdk.com/en/catalog/datasheets/mlcc_commercial_general_en.pdf; Supplier Part Number 1: 445-9015-2-ND; Ratings: -; Capacitance: 10µF
C39 C40 C65 C84 C90 = 1.0µF 0402 X5R 35V: CAP CER 1UF 35V 10% X5R 0402; Manufacturer: TDK Corporation; Manufacturer Part Number: C1005X5R1V105K050BC; Supplier 1: Digi-Key; RoHS: RoHS Compliant; Category: Capacitors; Stock 1: 47833; Pricing 1: 0.0186; Packaging: Tape & Reel (TR); Tolerance: ±10%; Voltage - Rated: 35V; Temperature Coefficient: X5R; Mounting Type: Surface Mount, MLCC; Operating Temperature: -55°C ~ 125°C; Applications: General Purpose; Package / Case: 0402 (1005 Metric); Size / Dimension: 0.039" L x 0.020" W (1.00mm x 0.50mm); Height - Seated (Max): -; Thickness (Max): 0.022" (0.55mm); Lead Spacing: -; Features: -; Lead Style: -; ComponentLink1URL: http://product.tdk.com/en/catalog/datasheets/mlcc_commercial_general_en.pdf; ComponentLink1Description: http://product.tdk.com/en/catalog/datasheets/mlcc_commercial_general_en.pdf; Supplier Part Number 1: 445-9073-2-ND; Ratings: -; Capacitance: 1.0µF
C49 C50 C53 = 10µF 0402 X5R 6.3V: CAP CER 10UF 6.3V 20% X5R 0402; Manufacturer: TDK Corporation; Manufacturer Part Number: C1005X5R0J106M050BC; Supplier 1: Digi-Key; RoHS: RoHS Compliant; Category: Capacitors; Stock 1: 47833; Pricing 1: 0.07766; Packaging: Tape & Reel (TR); Tolerance: ±20%; Voltage - Rated: 6.3V; Temperature Coefficient: X5R; Mounting Type: Surface Mount, MLCC; Operating Temperature: -55°C ~ 125°C; Applications: General Purpose; Package / Case: 0402 (1005 Metric); Size / Dimension: 0.039" L x 0.020" W (1.00mm x 0.50mm); Height - Seated (Max): -; Thickness (Max): 0.020" (0.50mm); Lead Spacing: -; Features: -; Lead Style: -; ComponentLink1URL: http://product.tdk.com/en/catalog/datasheets/mlcc_commercial_general_en.pdf; ComponentLink1Description: http://product.tdk.com/en/catalog/datasheets/mlcc_commercial_general_en.pdf; Supplier Part Number 1: 445-8920-2-ND; Ratings: -; Capacitance: 10µF
C52 C56-C61 C71 C72 C85 = 0.1µF 0402 X7R 50V: CAP CER 0.1UF 50V 10% X7R 0402; Manufacturer: TDK Corporation; Manufacturer Part Number: C1005X7R1H104K050BB; Supplier 1: Digi-Key; RoHS: RoHS Compliant; Category: Capacitors; Stock 1: 47833; Pricing 1: 0.01305; Packaging: Tape & Reel (TR); Tolerance: ±10%; Voltage - Rated: 50V; Temperature Coefficient: X7R; Mounting Type: Surface Mount, MLCC; Operating Temperature: -55°C ~ 125°C; Applications: General Purpose; Package / Case: 0402 (1005 Metric); Size / Dimension: 0.039" L x 0.020" W (1.00mm x 0.50mm); Height - Seated (Max): -; Thickness (Max): 0.022" (0.55mm); Lead Spacing: -; Features: -; Lead Style: -; ComponentLink1URL: http://product.tdk.com/en/catalog/datasheets/mlcc_commercial_general_en.pdf; ComponentLink1Description: http://product.tdk.com/en/catalog/datasheets/mlcc_commercial_general_en.pdf; Supplier Part Number 1: 445-5932-2-ND; Ratings: -; Capacitance: 0.1µF
C55 C76 C79 C81 C83 = 2.2µF 0402 X5R 35V: CAP CER 2.2UF 35V 10% X5R 0402; Manufacturer: TDK Corporation; Manufacturer Part Number: C1005X5R1V225K050BC; Supplier 1: Digi-Key; RoHS: RoHS Compliant; Category: Capacitors; Stock 1: 47833; Pricing 1: 0.04177; Packaging: Tape & Reel (TR); Tolerance: ±10%; Voltage - Rated: 35V; Temperature Coefficient: X5R; Mounting Type: Surface Mount, MLCC; Operating Temperature: -55°C ~ 125°C; Applications: General Purpose; Package / Case: 0402 (1005 Metric); Size / Dimension: 0.039" L x 0.020" W (1.00mm x 0.50mm); Height - Seated (Max): -; Thickness (Max): 0.022" (0.55mm); Lead Spacing: -; Features: -; Lead Style: -; ComponentLink1URL: http://product.tdk.com/en/catalog/datasheets/mlcc_commercial_general_en.pdf; ComponentLink1Description: http://product.tdk.com/en/catalog/datasheets/mlcc_commercial_general_en.pdf; Supplier Part Number 1: 445-9028-2-ND; Ratings: -; Capacitance: 2.2µF
C62-C64 C67-C70 = 0.47µF 0402 X5R 35V: CAP CER 0.47UF 35V 10% X5R 0402; Manufacturer: TDK Corporation; Manufacturer Part Number: C1005X5R1V474K050BC; Supplier 1: Digi-Key; RoHS: RoHS Compliant; Category: Capacitors; Stock 1: 47833; Pricing 1: 0.01762; Packaging: Tape & Reel (TR); Tolerance: ±10%; Voltage - Rated: 35V; Temperature Coefficient: X5R; Mounting Type: Surface Mount, MLCC; Operating Temperature: -55°C ~ 125°C; Applications: General Purpose; Package / Case: 0402 (1005 Metric); Size / Dimension: 0.039" L x 0.020" W (1.00mm x 0.50mm); Height - Seated (Max): -; Thickness (Max): 0.022" (0.55mm); Lead Spacing: -; Features: -; Lead Style: -; ComponentLink1URL: http://product.tdk.com/en/catalog/datasheets/mlcc_commercial_general_en.pdf; ComponentLink1Description: http://product.tdk.com/en/catalog/datasheets/mlcc_commercial_general_en.pdf; Supplier Part Number 1: 445-13864-2-ND; Ratings: -; Capacitance: 0.47µF
C74 = 4.7µF 0402 X5R 10V: CAP CER 4.7UF 10V 10% X5R 0402; Manufacturer: TDK Corporation; Manufacturer Part Number: C1005X5R1A475K050BC; Supplier 1: Digi-Key; RoHS: RoHS Compliant; Category: Capacitors; Stock 1: 47833; Pricing 1: 0.06265; Packaging: Tape & Reel (TR); Tolerance: ±10%; Voltage - Rated: 10V; Temperature Coefficient: X5R; Mounting Type: Surface Mount, MLCC; Operating Temperature: -55°C ~ 125°C; Applications: General Purpose; Package / Case: 0402 (1005 Metric); Size / Dimension: 0.039" L x 0.020" W (1.00mm x 0.50mm); Height - Seated (Max): -; Thickness (Max): 0.022" (0.55mm); Lead Spacing: -; Features: -; Lead Style: -; ComponentLink1URL: http://product.tdk.com/en/catalog/datasheets/mlcc_commercial_general_en.pdf; ComponentLink1Description: http://product.tdk.com/en/catalog/datasheets/mlcc_commercial_general_en.pdf; Supplier Part Number 1: 445-13820-2-ND; Ratings: -; Capacitance: 4.7µF
C75 C77 C78 C80 C82 = 10pF 0402 C0G, NP0 50V: CAP CER 10PF 50V NP0 0402; Manufacturer: TDK Corporation; Manufacturer Part Number: C1005C0G1H100D050BA; Tolerance: ±0.5pF; Supplier 1: Digi-Key; RoHS: RoHS Compliant; Category: Capacitors; Stock 1: 47833; Pricing 1: 0.00274; Packaging: Tape & Reel (TR); Voltage - Rated: 50V; Temperature Coefficient: C0G, NP0; Mounting Type: Surface Mount, MLCC; Operating Temperature: -55°C ~ 125°C; Applications: General Purpose; Package / Case: 0402 (1005 Metric); Size / Dimension: 0.039" L x 0.020" W (1.00mm x 0.50mm); Height - Seated (Max): -; Thickness (Max): 0.022" (0.55mm); Lead Spacing: -; Features: -; Lead Style: -; ComponentLink1URL: http://product.tdk.com/en/catalog/datasheets/mlcc_commercial_general_en.pdf; ComponentLink1Description: http://product.tdk.com/en/catalog/datasheets/mlcc_commercial_general_en.pdf; Supplier Part Number 1: 445-1235-2-ND; Ratings: -; Capacitance: 10pF
J1 = MOLEX-0022284020: CONN HEADER 2POS .100 VERT TIN; Manufacturer: Molex, LLC; Connector Type: Header, Unshrouded, Breakaway; Number of Positions: 2; Number of Positions Loaded: All; Pitch: 0.100" (2.54mm); Supplier 1: Digi-Key; Manufacturer Part Number: 0022284020; RoHS: RoHS Compliant; Category: Connectors, Interconnects; Stock 1: 10077; Pricing 1: 1=0.12, 10=0.108, 25=0.0808, 50=0.0692, 100=0.0668, 250=0.0576, 500=0.0553 (GBP); Packaging: Bulk; Contact Type: Male Pin; Number of Rows: 1; Row Spacing: -; Contact Mating Length: 0.240" (6.10mm); Mounting Type: Through Hole; Termination: Solder; Fastening Type: -; Features: -; Contact Finish: Tin; Contact Finish Thickness: 100µin (2.54µm); Color: Black; ComponentLink1URL: http://www.molex.com/pdm_docs/sd/022284020_sd.pdf; ComponentLink1Description: http://www.molex.com/pdm_docs/sd/022284020_sd.pdf; Supplier Part Number 1: WM50014-02-ND
L10 = MAMK2520T2R2M: FIXED IND 2.2UH 1.9A 117 MOHM; Manufacturer: Taiyo Yuden; Type: Wirewound; Material - Core: Metal; Tolerance: ±20%; Current - Saturation: 2A; Shielding: Shielded; DC Resistance (DCR): 117 mOhm Max; Frequency - Test: 2MHz; Supplier 1: Digi-Key; Manufacturer Part Number: MAMK2520T2R2M; RoHS: RoHS Compliant; Category: Inductors, Coils, Chokes; Stock 1: 7120; Pricing 1: 1=0.34, 10=0.306, 25=0.2864, 50=0.2482, 100=0.2291, 250=0.21768, 500=0.19858, 1000=0.16803 (GBP); Packaging: Cut Tape (CT); Inductance: 2.2µH; Current Rating: 1.9A; Q @ Freq: -; Frequency - Self Resonant: -; Ratings: -; Operating Temperature: -40°C ~ 105°C; Mounting Type: Surface Mount; Package / Case: 1008 (2520 Metric); Size / Dimension: 0.098" L x 0.079" W (2.50mm x 2.00mm); Height - Seated (Max): 0.047" (1.20mm); ComponentLink1URL: http://ds.yuden.co.jp/TYCOMPAS/ut/detail.do?productNo=MAMK2520T2R2M&fileName=MAMK2520T2R2M_SS&mode=specSheetDownload; ComponentLink1Description: http://ds.yuden.co.jp/TYCOMPAS/ut/detail.do?productNo=MAMK2520T2R2M&fileName=MAMK2520T2R2M_SS&mode=specSheetDownload; Supplier Part Number 1: 587-3226-1-ND
U1 = MT3620AN: Manufacturer: MediaTek Inc.; Manufacturer Part Number: MT3620AN; Supplier Part Number 1: MT3620AN; Supplier 1: MediaTek Inc.

## Sheet P-MT3620RDB-1-0_Dev.SchDoc: MT3620 RDB Dev
size A3; CompanyName: Microsoft Research; DrawnBy: Stuart Taylor; Revision: 1.0; SheetNumber: 5; SheetTotal: 5; ProjectName: MT3620 Reference Development Board
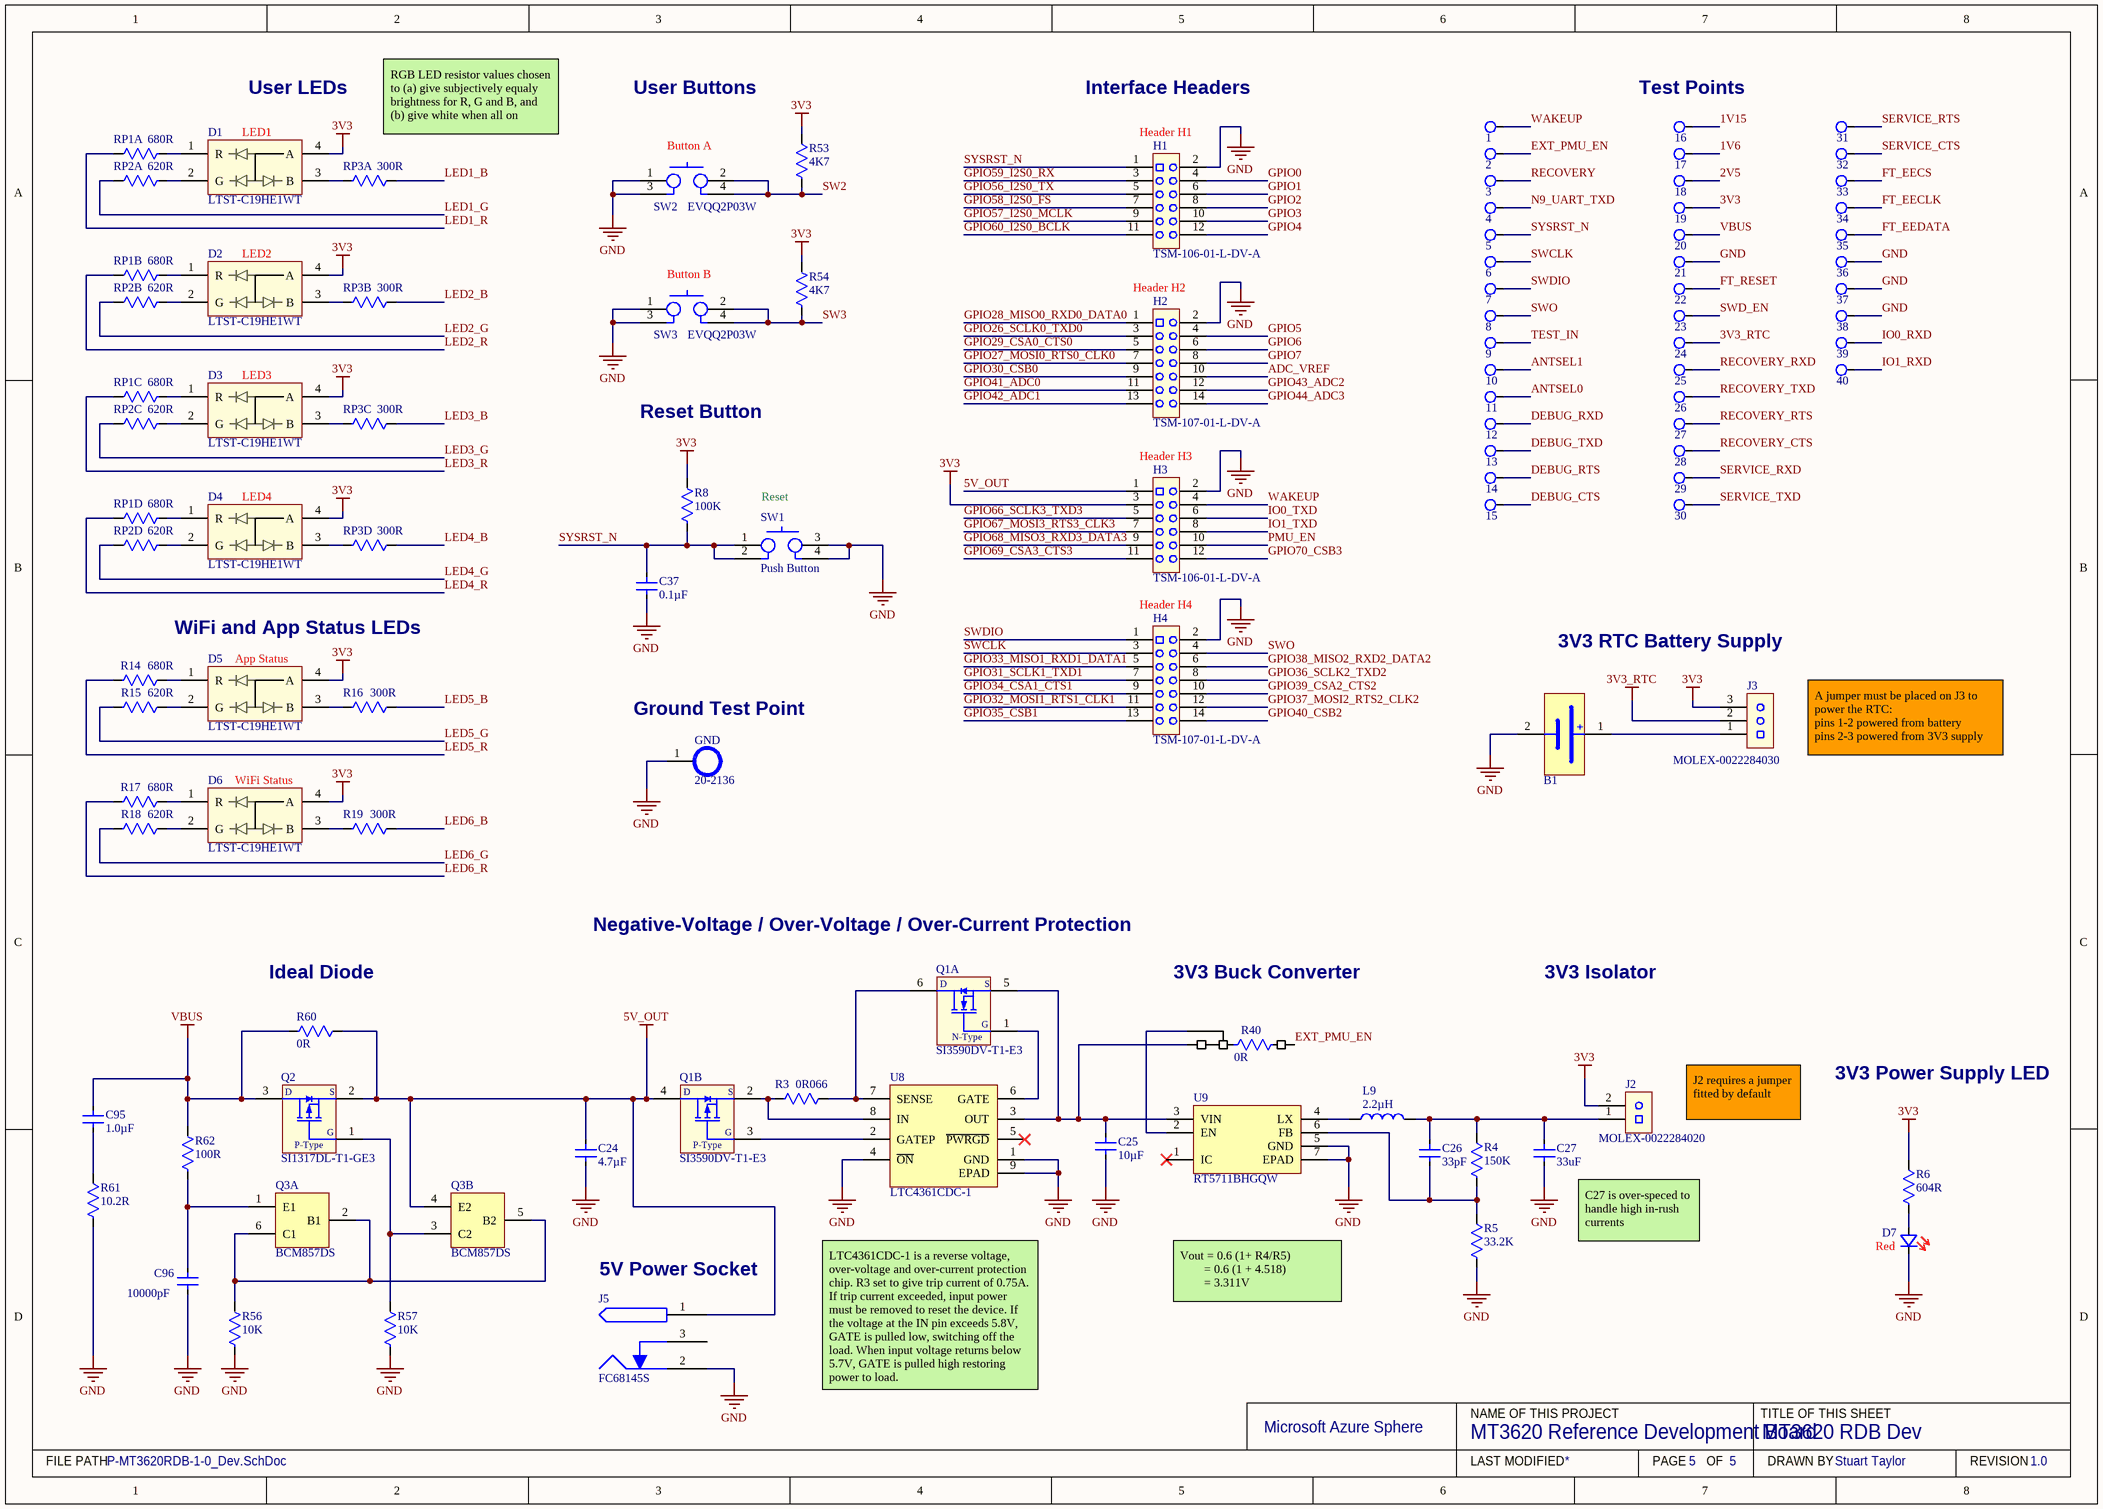
[diagram p4: P-MT3620RDB-1-0_Dev.SchDoc]

### Parts
1  TestPoint  [Pad1.27mm]  (value not drawn)  (no BOM)
2  TestPoint  [Pad1.27mm]  (value not drawn)  (no BOM)
3  TestPoint  [Pad1.27mm]  (value not drawn)  (no BOM)
4  TestPoint  [Pad1.27mm]  (value not drawn)  (no BOM)
5  TestPoint  [Pad1.27mm]  (value not drawn)  (no BOM)
6  TestPoint  [Pad1.27mm]  (value not drawn)  (no BOM)
7  TestPoint  [Pad1.27mm]  (value not drawn)  (no BOM)
8  TestPoint  [Pad1.27mm]  (value not drawn)  (no BOM)
9  TestPoint  [Pad1.27mm]  (value not drawn)  (no BOM)
10  TestPoint  [Pad1.27mm]  (value not drawn)  (no BOM)
11  TestPoint  [Pad1.27mm]  (value not drawn)  (no BOM)
12  TestPoint  [Pad1.27mm]  (value not drawn)  (no BOM)
13  TestPoint  [Pad1.27mm]  (value not drawn)  (no BOM)
14  TestPoint  [Pad1.27mm]  (value not drawn)  (no BOM)
15  TestPoint  [Pad1.27mm]  (value not drawn)  (no BOM)
16  TestPoint  [Pad1.27mm]  (value not drawn)  (no BOM)
17  TestPoint  [Pad1.27mm]  (value not drawn)  (no BOM)
18  TestPoint  [Pad1.27mm]  (value not drawn)  (no BOM)
19  TestPoint  [Pad1.27mm]  (value not drawn)  (no BOM)
20  TestPoint  [Pad1.27mm]  (value not drawn)  (no BOM)
21  TestPoint  [Pad1.27mm]  (value not drawn)  (no BOM)
22  TestPoint  [Pad1.27mm]  (value not drawn)  (no BOM)
23  TestPoint  [Pad1.27mm]  (value not drawn)  (no BOM)
24  TestPoint  [Pad1.27mm]  (value not drawn)  (no BOM)
25  TestPoint  [Pad1.27mm]  (value not drawn)  (no BOM)
26  TestPoint  [Pad1.27mm]  (value not drawn)  (no BOM)
27  TestPoint  [Pad1.27mm]  (value not drawn)  (no BOM)
28  TestPoint  [Pad1.27mm]  (value not drawn)  (no BOM)
29  TestPoint  [Pad1.27mm]  (value not drawn)  (no BOM)
30  TestPoint  [Pad1.27mm]  (value not drawn)  (no BOM)
31  TestPoint  [Pad1.27mm]  (value not drawn)  (no BOM)
32  TestPoint  [Pad1.27mm]  (value not drawn)  (no BOM)
33  TestPoint  [Pad1.27mm]  (value not drawn)  (no BOM)
34  TestPoint  [Pad1.27mm]  (value not drawn)  (no BOM)
35  TestPoint  [Pad1.27mm]  (value not drawn)  (no BOM)
36  TestPoint  [Pad1.27mm]  (value not drawn)  (no BOM)
37  TestPoint  [Pad1.27mm]  (value not drawn)  (no BOM)
38  TestPoint  [Pad1.27mm]  (value not drawn)  (no BOM)
39  TestPoint  [Pad1.27mm]  (value not drawn)  (no BOM)
40  TestPoint  [Pad1.27mm]  (value not drawn)  (no BOM)
B1  HARWIN-S8421-45R  [HARWIN-S8421-45R]  (value not drawn)
C24  4.7µF  [CAPC1005-EIA0402 0.55MM MED]
C25  10µF  [CAPC1608-EIA0603-1MM-MED]
C26  33pF  [CAPC1005-EIA0402 0.55MM MED]
C27  33uF  [TDK_0805]
C37  0.1µF  [CAPC1005-EIA0402 0.55MM MED]
C95  1.0µF  [CAPC1005-EIA0402 0.55MM MED]
C96  10000pF  [CAPC1005-EIA0402 0.55MM MED]
D1  LTST-C19HE1WT  [LTST-C19HE1WT]
D2  LTST-C19HE1WT  [LTST-C19HE1WT]
D3  LTST-C19HE1WT  [LTST-C19HE1WT]
D4  LTST-C19HE1WT  [LTST-C19HE1WT]
D5  LTST-C19HE1WT  [LTST-C19HE1WT]
D6  LTST-C19HE1WT  [LTST-C19HE1WT]
D7  Colour: Red  [Rohm SML-D12 Red]  (hidden comment: Red LED)
GND  20-2136  [20-2136]
H1  TSM-106-01-L-DV-A  [TSM-106-01-L-DV-A]
H2  TSM-107-01-L-DV-A  [TSM-107-01-L-DV-A]
H3  TSM-106-01-L-DV-A  [TSM-106-01-L-DV-A]
H4  TSM-107-01-L-DV-A  [TSM-107-01-L-DV-A]
J2  MOLEX-0022284020  [0022284020]
J3  MOLEX-0022284030  [0022284030]
J5  FC68145S  [FC68145S]
L9  2.2µH  [NR3015T2R2M]
Q1  SI3590DV-T1-E3  [SI3590DV-T1-E3]  (parts A,B of 2)
Q2  SI1317DL-T1-GE3  [VISHAY_SOT-323]
Q3  BCM857DS  [NXP-SOT457]  (parts A,B of 2)
R3  0R066  [VISHAY-0603]
R4  150K  [RES 0402 MEDIUM DENSITY]
R5  33.2K  [RES 0402 MEDIUM DENSITY]
R6  604R  [RES 0402 MEDIUM DENSITY]
R8  100K  [RES 0402 MEDIUM DENSITY]
R14  680R  [RES 0402 MEDIUM DENSITY]
R15  620R  [RES 0402 MEDIUM DENSITY]
R16  300R  [RES 0402 MEDIUM DENSITY]
R17  680R  [RES 0402 MEDIUM DENSITY]
R18  620R  [RES 0402 MEDIUM DENSITY]
R19  300R  [RES 0402 MEDIUM DENSITY]
R40  0R  [THREE-WAY-0402-WITH-SHORT]  (net tie, no BOM)
R53  4K7  [RES 0402 MEDIUM DENSITY]
R54  4K7  [RES 0402 MEDIUM DENSITY]
R56  10K  [RES 0402 MEDIUM DENSITY]
R57  10K  [RES 0402 MEDIUM DENSITY]
R60  0R  [RES 0402 MEDIUM DENSITY]
R61  10.2R  [RES 0402 MEDIUM DENSITY]
R62  100R  [RES 0402 MEDIUM DENSITY]
RP1  680R  [EXB-N8V]  (parts A,B,C,D of 4)
RP2  620R  [EXB-N8V]  (parts A,B,C,D of 4)
RP3  300R  [EXB-N8V]  (parts A,B,C,D of 4)
SW1  Push Button  [DHT-1158]
SW2  SWI TACT SPN0 PANASONIC EVQQ2P03W  [EVQQ2P03W]  (value not drawn)
SW3  SWI TACT SPN0 PANASONIC EVQQ2P03W  [EVQQ2P03W]  (value not drawn)
U8  LTC4361CDC-1  [LTC4361-1#TRPBF]
U9  RT5711BHGQW  [SON65P200X80_HS-7N]

### Nets
3V3: 19.1 D1.4(A) D2.4(A) D3.4(A) D4.4(A) D5.4(A) D6.4(A) H3.3 J2.2 J3.3 R6.1 R8.1 R53.1 R54.1
3V3_RTC: 24.1 J3.2
5V_OUT: C24.2 H3.1 J5.1 Q1.4(D2) Q2.2(S) Q3.4(E2) R60.1
GND: 21.1 36.1 37.1 38.1 B1.2(-) C24.1 C25.1 C27.1 C37.1 C96.1 D7.1(K) GND.1 H1.2 H2.2 H3.2 H4.2 J5.2 R5.2 R56.2 R57.2 R61.2 SW1.3 SW1.4 SW2.1 SW2.3 SW3.1 SW3.3 U8.1(GND) U8.4(~{ON}) U8.9(EPAD) U9.5(GND) U9.7(EPAD)
VBUS: 20.1 C95.2 Q2.3(D) R60.2 R62.1
1V6: 17.1
1V15: 16.1
2V5: 18.1
ADC_VREF: H2.10
ANTSEL0: 11.1
ANTSEL1: 10.1
DEBUG_CTS: 15.1
DEBUG_RTS: 14.1
DEBUG_RXD: 12.1
DEBUG_TXD: 13.1
EXT_PMU_EN: 2.1 R40.1
FT_EECLK: 34.1
FT_EECS: 33.1
FT_EEDATA: 35.1
FT_RESET: 22.1
GPIO0: H1.4
GPIO1: H1.6
GPIO2: H1.8
GPIO3: H1.10
GPIO4: H1.12
GPIO5: H2.4
GPIO6: H2.6
GPIO7: H2.8
GPIO26_SCLK0_TXD0: H2.3
GPIO27_MOSI0_RTS0_CLK0: H2.7
GPIO28_MISO0_RXD0_DATA0: H2.1
GPIO29_CSA0_CTS0: H2.5
GPIO30_CSB0: H2.9
GPIO31_SCLK1_TXD1: H4.7
GPIO32_MOSI1_RTS1_CLK1: H4.11
GPIO33_MISO1_RXD1_DATA1: H4.5
GPIO34_CSA1_CTS1: H4.9
GPIO35_CSB1: H4.13
GPIO36_SCLK2_TXD2: H4.8
GPIO37_MOSI2_RTS2_CLK2: H4.12
GPIO38_MISO2_RXD2_DATA2: H4.6
GPIO39_CSA2_CTS2: H4.10
GPIO40_CSB2: H4.14
GPIO41_ADC0: H2.11
GPIO42_ADC1: H2.13
GPIO43_ADC2: H2.12
GPIO44_ADC3: H2.14
GPIO56_I2S0_TX: H1.5
GPIO57_I2S0_MCLK: H1.9
GPIO58_I2S0_FS: H1.7
GPIO59_I2S0_RX: H1.3
GPIO60_I2S0_BCLK: H1.11
GPIO66_SCLK3_TXD3: H3.5
GPIO67_MOSI3_RTS3_CLK3: H3.7
GPIO68_MISO3_RXD3_DATA3: H3.9
GPIO69_CSA3_CTS3: H3.11
GPIO70_CSB3: H3.12
IO0_RXD: 39.1
IO0_TXD: H3.6
IO1_RXD: 40.1
IO1_TXD: H3.8
LED1_B: RP3.2
LED1_G: RP2.2
LED1_R: RP1.2
LED2_B: RP3.4
LED2_G: RP2.4
LED2_R: RP1.4
LED3_B: RP3.6
LED3_G: RP2.6
LED3_R: RP1.6
LED4_B: RP3.8
LED4_G: RP2.8
LED4_R: RP1.8
LED5_B: R16.1
LED5_G: R15.2
LED5_R: R14.2
LED6_B: R19.1
LED6_G: R18.2
LED6_R: R17.2
N9_UART_TXD: 4.1
PMU_EN: H3.10
RECOVERY: 3.1
RECOVERY_CTS: 28.1
RECOVERY_RTS: 27.1
RECOVERY_RXD: 25.1
RECOVERY_TXD: 26.1
SERVICE_CTS: 32.1
SERVICE_RTS: 31.1
SERVICE_RXD: 29.1
SERVICE_TXD: 30.1
SW2: R53.2 SW2.2 SW2.4
SW3: R54.2 SW3.2 SW3.4
SWCLK: 6.1 H4.3
SWD_EN: 23.1
SWDIO: 7.1 H4.1
SWO: 8.1 H4.4
SYSRST_N: 5.1 C37.2 H1.1 R8.2 SW1.1 SW1.2
TEST_IN: 9.1
WAKEUP: 1.1 H3.4
NetB1_1: B1.1(+) J3.1
NetC25_2: C25.2 Q1.5(S1) R40.3 U8.3(OUT) U9.3(VIN)
NetC26_1: C26.1 R4.2 R5.1 U9.6(FB)
NetC26_2: C26.2 C27.2 J2.1 L9.2 R4.1
NetC95_1: C95.1 R61.1
NetC96_2: C96.2 Q3.1(E1) R62.2
NetD1_1: D1.1(R) RP1.1
NetD1_2: D1.2(G) RP2.1
NetD1_3: D1.3(B) RP3.1
NetD2_1: D2.1(R) RP1.3
NetD2_2: D2.2(G) RP2.3
NetD2_3: D2.3(B) RP3.3
NetD3_1: D3.1(R) RP1.5
NetD3_2: D3.2(G) RP2.5
NetD3_3: D3.3(B) RP3.5
NetD4_1: D4.1(R) RP1.7
NetD4_2: D4.2(G) RP2.7
NetD4_3: D4.3(B) RP3.7
NetD5_1: D5.1(R) R14.1
NetD5_2: D5.2(G) R15.1
NetD5_3: D5.3(B) R16.2
NetD6_1: D6.1(R) R17.1
NetD6_2: D6.2(G) R18.1
NetD6_3: D6.3(B) R19.2
NetD7_2: D7.2(A) R6.2
NetL9_1: L9.1 U9.4(LX)
NetQ1_1: Q1.1(G1) U8.6(GATE)
NetQ1_2: Q1.2(S2) R3.2 U8.8(IN)
NetQ1_3: Q1.3(G2) U8.2(GATEP)
NetQ1_6: Q1.6(D1) R3.1 U8.7(SENSE)
NetQ2_1: Q2.1(G) Q3.3(C2) R57.1
NetQ3_2: Q3.2(B1) Q3.5(B2) Q3.6(C1) R56.1
NetR40_2: R40.2 U9.2(EN)

Not connected (* = marked no-connect by the designer): J5 3; U8 5(~{PWRGD})*; U9 1(IC)*

### Notes on the sheet
- User LEDs
- User Buttons
- Interface Headers
- (near 16) Test Points
- (near D1) LED1
- (near RP3) RGB LED resistor values chosen to (a) give subjectively equaly brightness for R, G and B, and (b) give white when all on
- (near SW2) Button A
- (near H1) Header H1
- (near D2) LED2
- (near SW3) Button B
- (near H2) Header H2
- (near D3) LED3
- Reset Button
- (near D4) LED4
- (near SW1) Reset
- (near H3) Header H3
- WiFi and App Status LEDs
- Header H4
- 3V3 RTC Battery Supply
- (near D5) App Status
- (near GND) Ground Test Point
- (near D6) WiFi Status
- A jumper must be placed on J3 to power the RTC:
  pins 1-2 powered from battery
  pins 2-3 powered from 3V3 supply
- (near R60) Ideal Diode
- Negative-Voltage / Over-Voltage / Over-Current Protection
- (near R40) 3V3 Buck Converter
- 3V3 Isolator
- J2 requires a jumper fitted by default
- 3V3 Power Supply LED
- C27 is over-speced to handle high in-rush currents
- (near J5) 5V Power Socket
- Vout = 0.6 (1+ R4/R5)
  = 0.6 (1 + 4.518)
  = 3.311V
- LTC4361CDC-1 is a reverse voltage, over-voltage and over-current protection chip. R3 set to give trip current of 0.75A. If trip current exceeded, input power must be removed to reset the device. If the voltage at the IN pin exceeds 5.8V, GATE is pulled low, switching off the load. When input voltage returns below 5.7V, GATE is pulled high restoring power to load.
- Microsoft Azure Sphere
- NAME OF THIS PROJECT
- TITLE OF THIS SHEET
- FILE PATH
- LAST MODIFIED
- PAGE
- OF
- DRAWN BY
- REVISION
- (in symbol SI1317DL-T1-GE3) P-Type
- (in symbol SI3590DV-T1-E3, part A) D; S; G; N-Type
- (in symbol SI3590DV-T1-E3, part B) D; S; G; P-Type